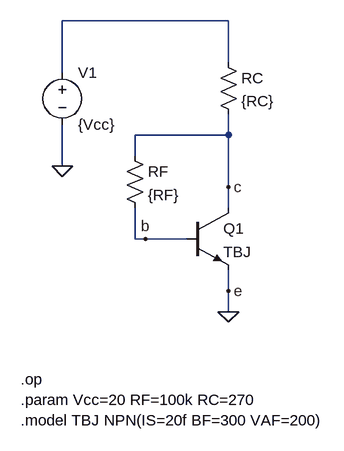
[diagram p0: schematic Q04 - Questão 4.asc]
Q04 - Questão 4.asc, the LTspice schematic file:
Version 4
SHEET 1 880 680
WIRE 320 -16 64 -16
WIRE 320 48 320 -16
WIRE 64 64 64 -16
WIRE 320 160 320 128
WIRE 320 160 176 160
WIRE 176 192 176 160
WIRE 64 208 64 144
WIRE 320 240 320 160
WIRE 320 272 320 240
WIRE 176 320 176 272
WIRE 192 320 176 320
WIRE 256 320 192 320
WIRE 320 400 320 368
WIRE 320 432 320 400
FLAG 320 432 0
FLAG 64 208 0
FLAG 320 240 c
FLAG 192 320 b
FLAG 320 400 e
SYMBOL voltage 64 48 R0
SYMATTR InstName V1
SYMATTR Value {Vcc}
SYMBOL res 304 32 R0
SYMATTR InstName RC
SYMATTR Value {RC}
SYMBOL res 160 176 R0
SYMATTR InstName RF
SYMATTR Value {RF}
SYMBOL npn 256 272 R0
SYMATTR InstName Q1
SYMATTR Value TBJ
TEXT 0 536 Left 2 !.op
TEXT 0 568 Left 2 !.param Vcc=20 RF=100k RC=270\n.model TBJ NPN(IS=20f BF=300 VAF=200)

The netlist it stands for:
* Q04 - Questão 4.asc
V1 N001 0 {Vcc}
RC N001 c {RC}
RF c b {RF}
Q1 c b 0 0 TBJ
.model NPN NPN
.model PNP PNP
.lib standard.bjt
.op
.param Vcc=20 RF=100k RC=270
.model TBJ NPN(IS=20f BF=300 VAF=200)
.backanno
.end